# EasyEDA Pro project mspm0l1306拓展板.epro

# Schematic Schematic1_1
Create Date: 2024-07-17; Page Name: P1; Project Name: 2024电赛 7.17; Schematic Name: Schematic1; Update Date: 2024-07-18; Company: 嘉立创EDA; Page Size: A3; Version: V1.0
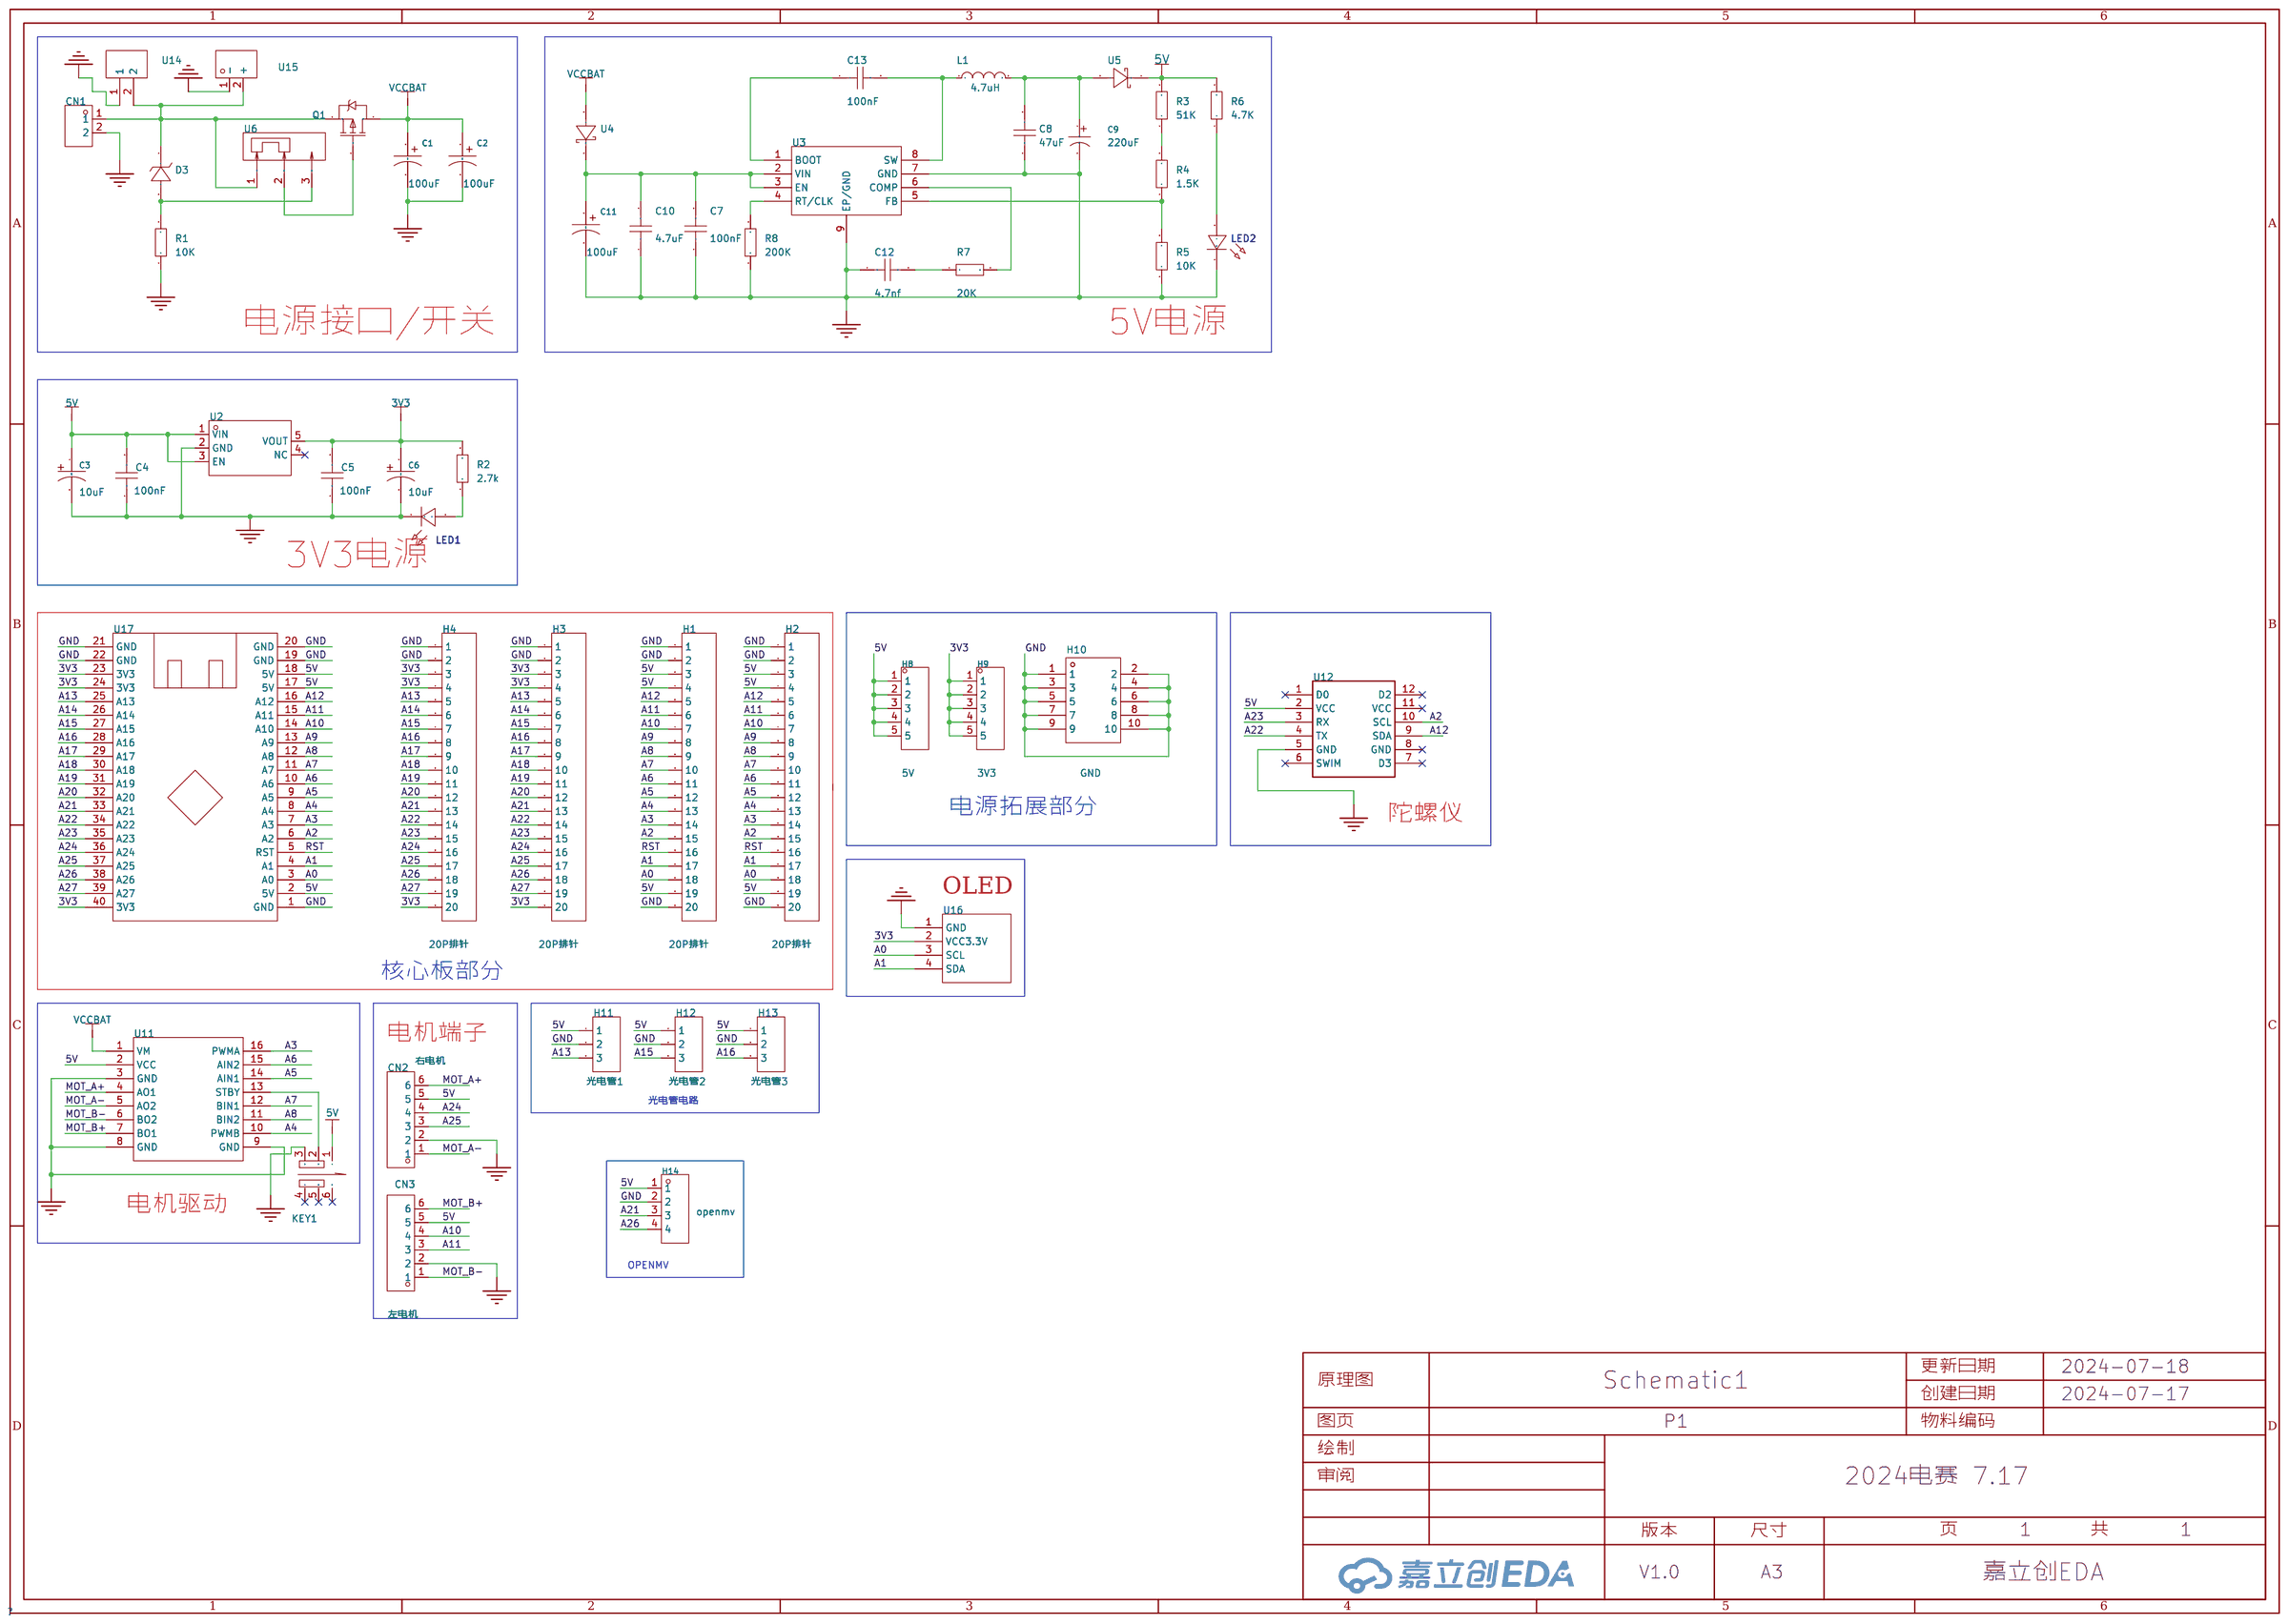
[diagram p0: schematic sheet]

## Parts
C1  100uF  [CAP-TH_BD8.0-P3.50-D0.6-FD_1]
C2  100uF  [CAP-TH_BD8.0-P3.50-D0.6-FD_1]
C3  10uF  [CAP-TH_BD8.0-P3.50-D0.6-FD_1]
C4  100nF  [C0805]
C5  100nF  [C0805]
C6  10uF  [CAP-TH_BD8.0-P3.50-D0.6-FD_1]
C7  100nF  [C0805]
C8  47uF  [C0805]
C9  220uF  [CAP-TH_BD8.0-P3.50-D0.6-FD_1]
C10  4.7uF  [C0805]
C11  100uF  [CAP-TH_BD8.0-P3.50-D0.6-FD_1]
C12  4.7nf  [C0805]
C13  100nF  [C0805]
CN1  XT30U-M  [CONN-TH_XT30U-M]
CN2  右电机  [CONN-TH_XH2.54-6P]
CN3  左电机  [CONN-TH_XH2.54-6P]
D3  BZT52C16  [SOD-123_L2.7-W1.6-LS3.7-RD]
H1  20P排针  [HDR-TH_20P-P2.54-V-F]
H2  20P排针  [HDR-TH_20P-P2.54-V-F]
H3  20P排针  [HDR-TH_20P-P2.54-V-F]
H4  20P排针  [HDR-TH_20P-P2.54-V-F]
H8  5V  [HDR-TH_5P-P2.54-V-M]
H9  3V3  [HDR-TH_5P-P2.54-V-M]
H10  GND  [HDR-TH_10P-P2.54-V-M-R2-C5-S2.54]
H11  光电管1  [HDR-F-2.54_1X3]
H12  光电管2  [HDR-F-2.54_1X3]
H13  光电管3  [HDR-F-2.54_1X3]
H14  openmv  [HDR-TH_4P-P2.54-V-F]
KEY1  自锁开关 5.8Z白灰白260G  [SW-TH_6P-L5.8-W5.8-P2.00-LS4.5-TR]
L1  4.7uH  [IND-TH_BD9.0-P5.00-D0.7]
LED1  -  [LED_0805]
LED2  -  [LED_0805]
Q1  HY19P03D  [TO-252-2_L6.6-W6.1-P4.57-LS9.9-TL-CW]
R1  10K  [R0805]
R2  2.7k  [R0805]
R3  51K  [R0805]
R4  1.5K  [R0805]
R5  10K  [R0805]
R6  4.7K  [R0805]
R7  20K  [R0805]
R8  200K  [R0805]
U2  RT9013-3.3GB  [SOT-23-5_L2.9-W1.6-P0.94-LS2.8-BL]
U3  -  [ESOP-8_L4.9-W3.9-P1.27-LS6.0-BL-EP3.1]
U4  SS54  [SMA_L4.2-W2.6-LS5.1-RD]
U5  SS54  [SMA_L4.2-W2.6-LS5.1-RD]
U6  SS-12D10-G5  [SW-TH_SS-12D10-G050]
U11  -  [tb6612]
U12  MPU6050(JY6X)  [维特陀螺仪]
U14  -  [T插头]
U15  XT60  [CONN-TH_XT60]
U16  -  [oled_4p]
U17  -  [MspM0L1306]

## Library data of the parts
C1 C2 C11 = 35YXF100MEFCTA8X11.5: 容值:100uF;精度:±20%;额定电压:35V;纹波电流:280mA@120Hz;等效串联电阻:-;; LCSC Part Name: 100uF ±20% 35V; Supplier Part: C1592816; Manufacturer: rubycon(红宝石); Supplier Footprint: 插件; JLCPCB Part Class: Extended Part; Datasheet: https://atta.szlcsc.com/upload/public/pdf/source/20220328/A5ADB66C04EDDB14C10F1D30FE958B67.pdf; Supplier: LCSC; Tolerance: ±20%; Rated Voltage: 35V; Lead Spacing: 3.5mm; Ripple Current: 280mA@120Hz; Lifetime @ Temp: 7000hrs@105℃; Operating Temperature: -40℃~+105℃
C3 C6 = LKMD0902E100MF: 容值:10uF;精度:±20%;额定电压:250V;纹波电流:210mA@100kHz;等效串联电阻:10Ω@100kHz;; LCSC Part Name: 10uF ±20% 250V; Supplier Part: C443244; Manufacturer: Ymin(永铭); Supplier Footprint: 插件,D8xL9mm; JLCPCB Part Class: Extended Part; Datasheet: https://atta.szlcsc.com/upload/public/pdf/source/20200220/C487520_443A40905984A455D375EE990FEAA9E8.pdf; Supplier: LCSC; Tolerance: ±20%; Rated Voltage: 250V; φD: 8mm; L: 9mm; Lead Spacing: 3.5mm; Ripple Current: 210mA@100kHz; Equivalent Series Resistance(ESR): 10Ω@100kHz; Lifetime @ Temp: 10000hrs@105℃
C4 C5 C7 C8 C10 C12 C13 = CAP_0805: Supplier Footprint: 0805
C9 = 25RX30220M8X11.5: 容值:220uF;精度:±20%;额定电压:25V;纹波电流:252mA@120Hz;等效串联电阻:220mΩ;; LCSC Part Name: 220uF ±20% 25V; Supplier Part: C1650893; Manufacturer: rubycon(红宝石); Supplier Footprint: 插件,D8xL11.5mm; JLCPCB Part Class: Extended Part; Datasheet: https://atta.szlcsc.com/upload/public/pdf/source/20210702/8607D86FC441D4E601D160AD5603FFB5.pdf; Supplier: LCSC; Tolerance: ±20%; Rated Voltage: 25V; φD: 8mm; L: 11.5mm; Lead Spacing: 3.5mm; Ripple Current: 252mA@120Hz; Equivalent Series Resistance(ESR): 220mΩ; Lifetime @ Temp: 2000hrs@130℃; Operating Temperature: -40℃~+130℃
CN1 = XT30U-M: 模型插头轻量版锂电池插头; LCSC Part Name: AMASS(艾迈斯)轻量版锂电池插头公头 XT30U-M; Supplier Part: C99101; Manufacturer: AMASS(艾迈斯); JLCPCB Part Class: Extended Part; Datasheet: https://atta.szlcsc.com/upload/public/pdf/source/20170606/1496716542582.pdf; Supplier: LCSC
CN2 CN3 = XH2.54*6P_直插: Supplier Part: C9900008614; Supplier Footprint: XH2.54_6P; JLCPCB Part Class: Extended Part; Supplier: LCSC
D3 = BZT52C16: 稳压值(标称值):-;精度:-;功率:500mW;反向电流(Ir):100nA@11.2V;; LCSC Part Name: 500mW; Supplier Part: C707145; Manufacturer: Slkor(萨科微); Supplier Footprint: SOD-123; JLCPCB Part Class: Extended Part; Datasheet: https://atta.szlcsc.com/upload/public/pdf/source/20200721/C707125_BAEA70ACC1B0F60BBAC1FD71D8806D24.pdf; Supplier: LCSC; Power Dissipation: 500mW; Reverse Leakage Current (Ir): 100nA@11.2V
H1-H4 = HDR-F_2.54_1x20P: Supplier Part: C50984; Supplier Footprint: 插件
H8 H9 = HDR-M_2.54_1x5P: Supplier Part: C358687; Supplier Footprint: 插件
H10 = HDR-M_2.54_2x5: Supplier Part: C124387; Supplier Footprint: 插件,P=2.54mm
H11-H13 = HDR-F-2.54_1x3: link: https://www.cjt.com/Upload/A2541.pdf; Supplier Part: C146690; Supplier: LCSC; JLCPCB Part Class: 扩展库
H14 = HDR-F_2.54_1x4P: Supplier Part: C2718488; Supplier Footprint: 插件
KEY1 = 自锁开关 5.8Z白灰白260G: 耐温260度; LCSC Part Name: 自锁开关 5.8Z白灰白 260G  5.8*5.8mm; Supplier Part: C56857; Supplier Footprint: Through Hole; JLCPCB Part Class: Extended Part; Datasheet: https://atta.szlcsc.com/upload/public/pdf/source/20160318/1458266987096.pdf; Supplier: LCSC
L1 = PK0810-470MB: 电感值:47uH;精度:±20%;额定电流:1.5A;; LCSC Part Name: 47uH ±20% 1.5A 100mΩ; Supplier Part: C400313; Manufacturer: SXN(顺翔诺); Supplier Footprint: 插件; JLCPCB Part Class: Extended Part; Datasheet: https://atta.szlcsc.com/upload/public/pdf/source/20210810/BA6D1DA7D4BCBB7C641BC97B42CFC6FF.pdf; Supplier: LCSC; Tolerance: ±20%; Rated Current: 1.5A; DC Resistance (DCR): 100mΩ
LED1 LED2 = LED_0805-G: Supplier Footprint: 0805
Q1 = HY19P03D: 类型:P沟道;漏源电压(Vdss):30V;连续漏极电流(Id):90A;功率(Pd):50W;导通电阻(RDS(on)@Vgs,Id):6mΩ@10V,45A;阈值电压(Vgs(th)@Id):3V@250uA;; LCSC Part Name: P沟道 30V 90A; Supplier Part: C122492; Manufacturer: HUAYI(华羿微); Supplier Footprint: TO-252-2; JLCPCB Part Class: Extended Part; Datasheet: https://atta.szlcsc.com/upload/public/pdf/source/20170728/C122492_1501225751911848809.pdf; Supplier: LCSC; Type: P沟道; Drain Source Voltage (Vdss): 30V; Continuous Drain Current (Id): 90A; Power Dissipation (Pd): 50W; Drain Source On Resistance (RDS(on)@Vgs,Id): 6mΩ@10V,45A; Gate Threshold Voltage (Vgs(th)@Id): 3V@250uA
R1-R8 = Res_0805: Supplier Footprint: 0805
U2 = RT9013-3.3GB: Supplier Part: C9900009203; Supplier Footprint: SOT-23-5; JLCPCB Part Class: Extended Part; Datasheet: 2022-03-03/158676S/05eef5539dd049ed90904f59fc365aec/RT9013_33GB_DS_EN.PDF; Supplier: LCSC
U3 = SP1N28STER
U4 U5 = SS54: Supplier Part: C9900023219; Supplier Footprint: (1N5824)DO-214; JLCPCB Part Class: Extended Part; Supplier: LCSC
U6 = SS-12D10-G5: LCSC Part Name: 插件大电流拨动开关; Supplier Part: C2998777; Manufacturer: DEALON(德艺隆); Supplier Footprint: 插件; JLCPCB Part Class: Extended Part; Datasheet: https://atta.szlcsc.com/upload/public/pdf/source/20220428/E10CB334ACBAF32CF4AF8D87DA871CD3.pdf; Supplier: LCSC
U11 = TB6612模块: STBY/VCC接3.3V VM接小于12V
U12 = 维特陀螺仪
U14 = T插头
U15 = XT60: 模型锂电连接器 XT60-M; LCSC Part Name: AMASS(艾迈斯) XT60模型插头 3.5mm镀金香蕉头公头（电调端）XT60-M; Supplier Part: C98733; Manufacturer: AMASS(艾迈斯); JLCPCB Part Class: Extended Part; Datasheet: https://atta.szlcsc.com/upload/public/pdf/source/20170606/1496716524919.pdf; Supplier: LCSC
U16 = OLED_4P
U17 = MspM0L1306核心板

## Nets
3V3: C5.2 C6.1 H3.3 H3.4 H3.20 H4.3 H4.4 H4.20 H9.1 H9.2 H9.3 H9.4 H9.5 R2.2 U2.5(VOUT) U16.2(VCC3.3V) U17.23(3V3) U17.24(3V3) U17.40(3V3)
5V: C3.1 C4.2 CN2.5 CN3.5 H1.3 H1.4 H1.19 H2.3 H2.4 H2.19 H8.1 H8.2 H8.3 H8.4 H8.5 H11.1 H12.1 H13.1 H14.1 KEY1.1 R3.2 R6.2 U2.1(VIN) U2.3(EN) U5.1(C) U11.2(VCC) U12.2(VCC) U17.2(5V) U17.17(5V) U17.18(5V)
GND: C1.2 C2.2 C3.2 C4.1 C5.1 C6.2 C7.1 C8.1 C9.2 C10.1 C11.2 C12.1 CN1.2 CN2.2 CN3.2 H1.1 H1.2 H1.20 H2.1 H2.2 H2.20 H3.1 H3.2 H4.1 H4.2 H10.1 H10.2 H10.3 H10.4 H10.5 H10.6 H10.7 H10.8 H10.9 H10.10 H11.2 H12.2 H13.2 H14.2 KEY1.3 LED1.1(C) LED2.1(C) R1.1 R5.1 R8.1 U2.2(GND) U3.7(GND) U3.9(EP/GND) U11.3(GND) U11.8(GND) U11.9(GND) U12.5(GND) U14.1 U15.1(-) U16.1(GND) U17.1(GND) U17.19(GND) U17.20(GND) U17.21(GND) U17.22(GND)
VCCBAT: C1.1 C2.1 Q1.2(D) U4.2(A) U11.1(VM)
A0: H1.18 H2.18 U16.3(SCL) U17.3(A0)
A1: H1.17 H2.17 U16.4(SDA) U17.4(A1)
A2: H1.15 H2.15 U12.10(SCL) U17.6(A2)
A3: H1.14 H2.14 U11.16(PWMA) U17.7(A3)
A4: H1.13 H2.13 U11.10(PWMB) U17.8(A4)
A5: H1.12 H2.12 U11.14(AIN1) U17.9(A5)
A6: H1.11 H2.11 U11.15(AIN2) U17.10(A6)
A7: H1.10 H2.10 U11.12(BIN1) U17.11(A7)
A8: H1.9 H2.9 U11.11(BIN2) U17.12(A8)
A9: H1.8 H2.8 U17.13(A9)
A10: CN3.4 H1.7 H2.7 U17.14(A10)
A11: CN3.3 H1.6 H2.6 U17.15(A11)
A12: H1.5 H2.5 U12.9(SDA) U17.16(A12)
A13: H3.5 H4.5 H11.3 U17.25(A13)
A14: H3.6 H4.6 U17.26(A14)
A15: H3.7 H4.7 H12.3 U17.27(A15)
A16: H3.8 H4.8 H13.3 U17.28(A16)
A17: H3.9 H4.9 U17.29(A17)
A18: H3.10 H4.10 U17.30(A18)
A19: H3.11 H4.11 U17.31(A19)
A20: H3.12 H4.12 U17.32(A20)
A21: H3.13 H4.13 H14.3 U17.33(A21)
A22: H3.14 H4.14 U12.4(TX) U17.34(A22)
A23: H3.15 H4.15 U12.3(RX) U17.35(A23)
A24: CN2.4 H3.16 H4.16 U17.36(A24)
A25: CN2.3 H3.17 H4.17 U17.37(A25)
A26: H3.18 H4.18 H14.4 U17.38(A26)
A27: H3.19 H4.19 U17.39(A27)
MOT_A+: CN2.6 U11.4(AO1)
MOT_A-: CN2.1 U11.5(AO2)
MOT_B+: CN3.6 U11.7(BO1)
MOT_B-: CN3.1 U11.6(BO2)
RST: H1.16 H2.16 U17.5(RST)
$1N3369: LED1.2(A) R2.1
$1N3377: R8.2 U3.4(RT/CLK)
$1N3378: C7.2 C10.2 C11.1 U3.2(VIN) U3.3(EN) U4.1(C)
$1N3380: C12.2 R7.1
$1N3381: R7.2 U3.6(COMP)
$1N3382: C13.1 U3.1(BOOT)
$1N3383: C13.2 L1.1 U3.8(SW)
$1N3384: C8.2 C9.1 L1.2 U5.2(A)
$1N3386: R3.1 R4.2
$1N3387: R4.1 R5.2 U3.5(FB)
$1N3388: LED2.2(A) R6.1
Net-(CN1-1): CN1.1 D3.1(K) Q1.3(S) U6.1 U14.2 U15.2(+)
Net-(D3-2): D3.2(A) R1.2 U6.3
Net-(KEY1-2): KEY1.2 U11.13(STBY)
Net-(Q1-1): Q1.1(G) U6.2

Not connected (* = marked no-connect by the designer): KEY1 4* 5* 6*; U2 4(NC)*; U12 1(D0)* 6(SWIM)* 7(D3)* 8(GND)* 11(VCC)* 12(D2)*

## Notes on the sheet
- 电源接口/开关
- 5V电源
- 3V3电源
- 电源拓展部分
- 陀螺仪
- OLED
- 核心板部分
- 电机端子
- 光电管电路
- 电机驱动
- OPENMV

# Board PCB1_1
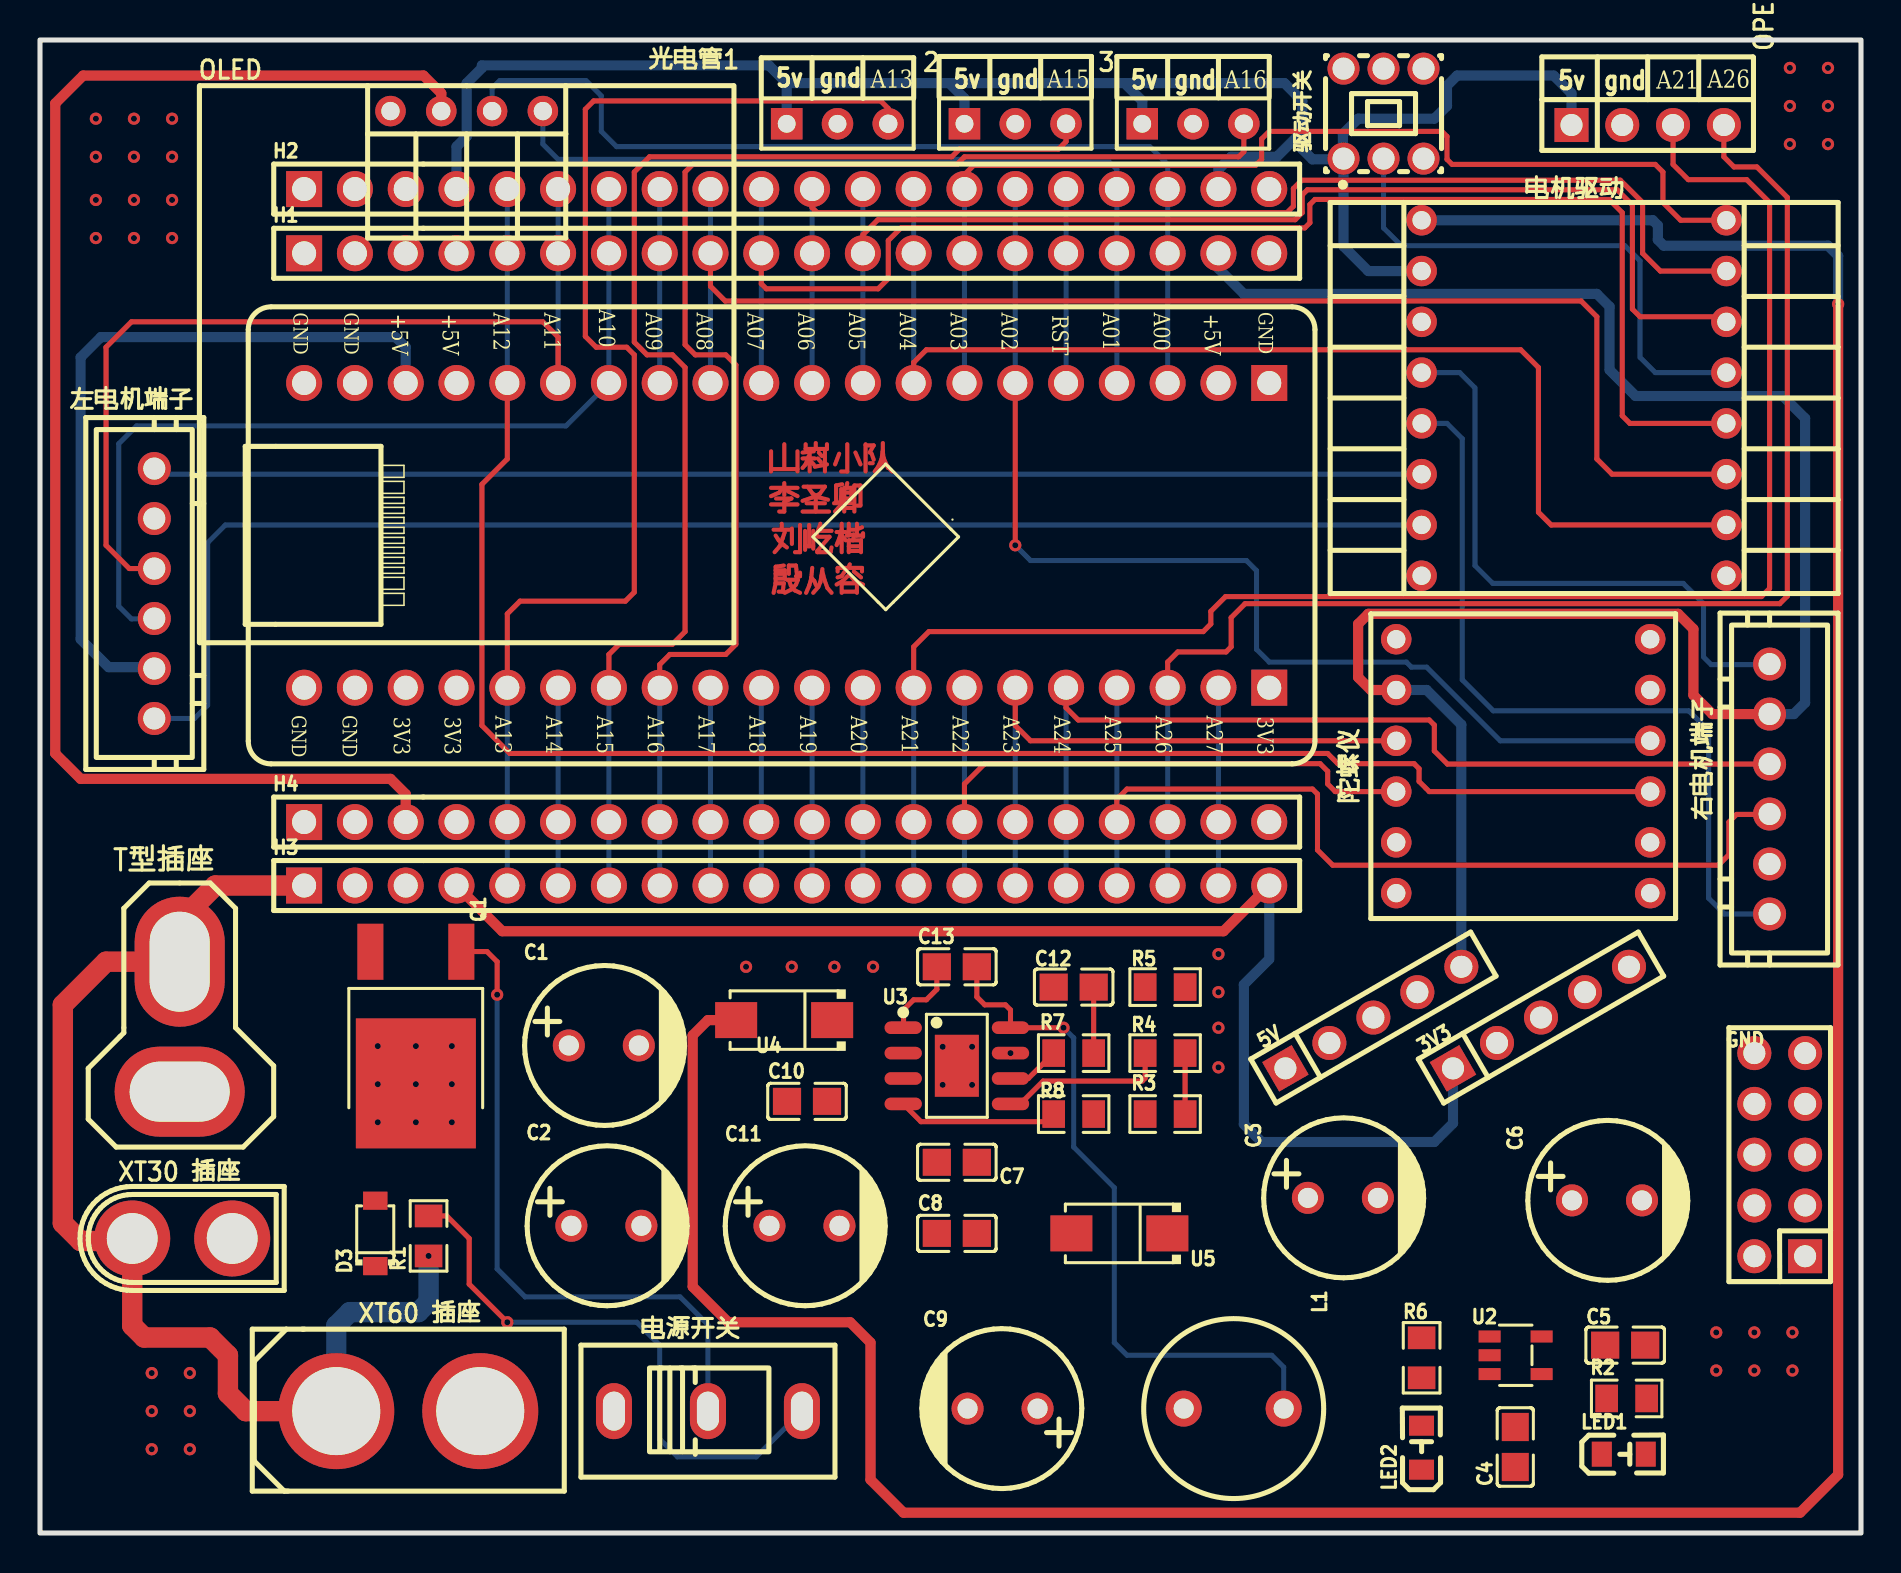
[diagram p1: board, top side]
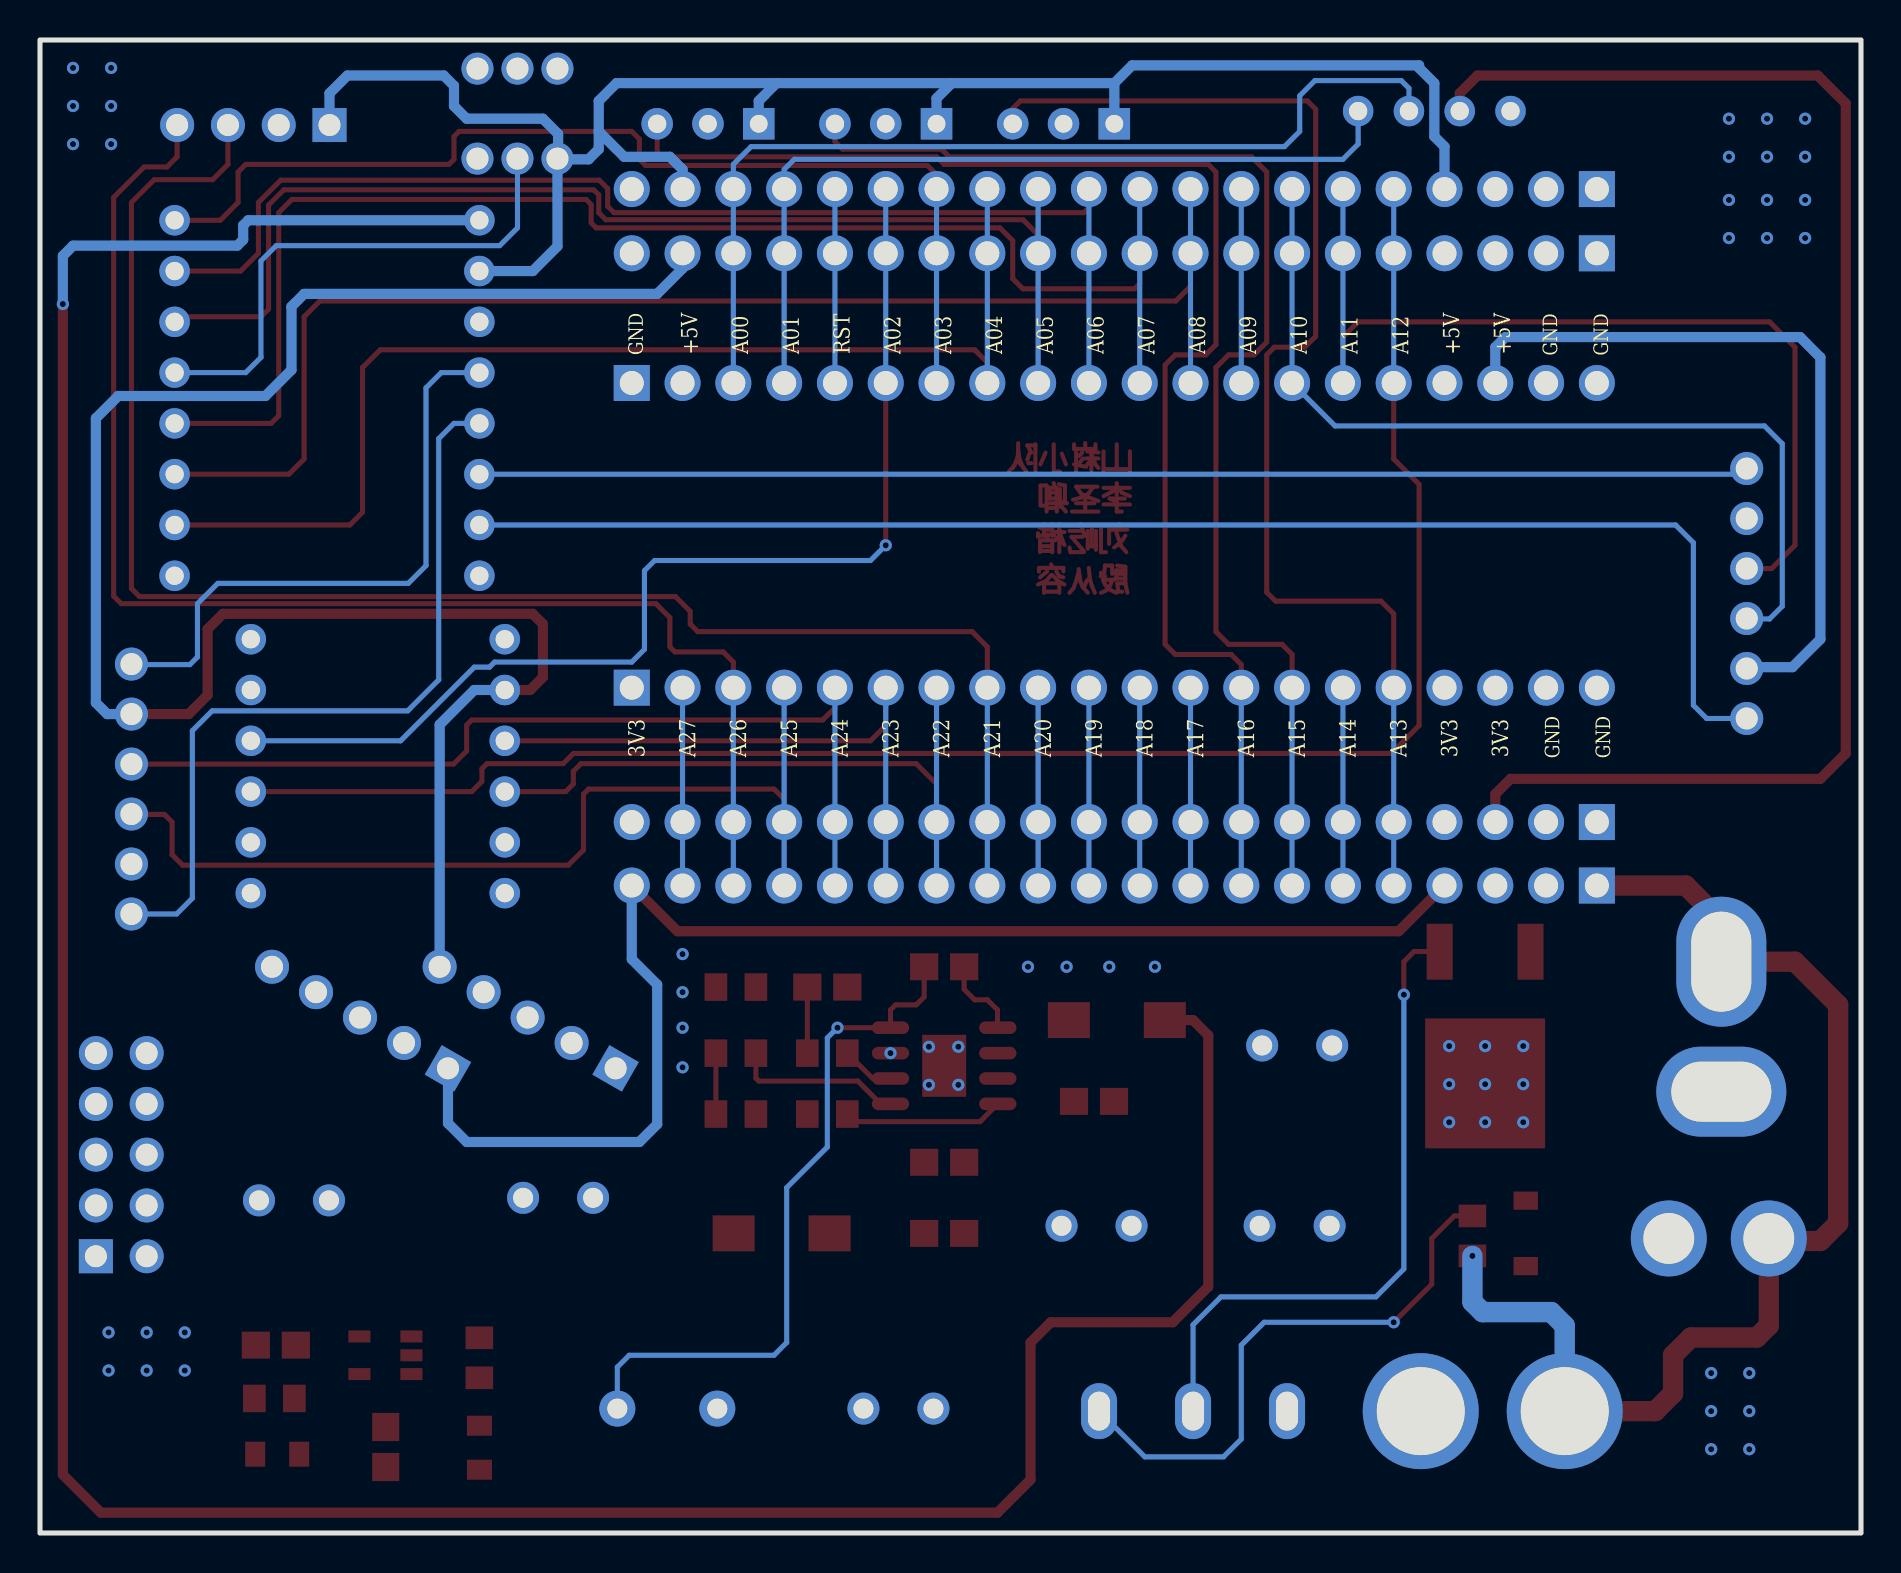
[diagram p2: board, bottom side, seen from below]

Outline 91.06 x 74.68 mm; copper layers: Top Layer, Bottom Layer. Coordinates in mm from the lower left corner of the outline.
Outline path: rectangle 0,74.68 91.06,0
Stack: Top Layer 0.035mm - / Dielectric1 1.51mm FR4 er 4.5 / Bottom Layer 0.035mm -

## Design rules (mm)
template: JLCPCB Capability(Two Layers Board)
spacing copperThickness1oz (default): track to track 0.102, other pairs 0.152 to 0.3
spacing copperThickness2oz: track to track 0.203, other pairs 0.152 to 0.3
track width copperThickness1oz (default): min 0.127, default 0.254, max 2.54
track width copperThickness2oz: min 0.203, default 0.254, max 2.54
differential pair differentialPair (default): width min 0.127, default 0.254, max 2.54; gap min 0.152, default 0.152
via viaSize (default): diameter min 0.5, default 0.61, max 10; hole min 0.3, default 0.305, max 6.3

## Placement (name value [footprint] x y rotation side)
2  -  [HDR-F-2.54_1X3]  48.77 70.48 0 top
3  -  [HDR-F-2.54_1X3]  57.66 70.48 0 top
3V3  -  [HDR-TH_5P-P2.54-V-M]  75.06 25.78 30 top
5V  -  [HDR-TH_5P-P2.54-V-M]  66.67 25.78 30 top
C1  100uF  [CAP-TH_BD8.0-P3.50-D0.6-FD_1]  28.19 24.38 0 top
C2  100uF  [CAP-TH_BD8.0-P3.50-D0.6-FD_1]  28.32 15.37 0 top
C3  10uF  [CAP-TH_BD8.0-P3.50-D0.6-FD_1]  65.15 16.76 0 top
C4  100nF  [C0805]  73.77 4.3 90 top
C5  100nF  [C0805]  79.27 9.4 180 top
C6  10uF  [CAP-TH_BD8.0-P3.50-D0.6-FD_1]  78.36 16.64 0 top
C7  100nF  [C0805]  45.85 18.54 180 top
C8  47uF  [C0805]  45.85 14.99 0 top
C9  220uF  [CAP-TH_BD8.0-P3.50-D0.6-FD_1]  48.13 6.22 180 top
C10  4.7uF  [C0805]  38.35 21.59 0 top
C11  100uF  [CAP-TH_BD8.0-P3.50-D0.6-FD_1]  38.23 15.37 0 top
C12  4.7nf  [C0805]  51.69 27.3 0 top
C13  100nF  [C0805]  45.85 28.32 0 top
D3  BZT52C16  [SOD-123_L2.7-W1.6-LS3.7-RD]  16.76 14.99 90 top
GND
  -  [HDR-TH_10P-P2.54-V-M-R2-C5-S2.54]  86.99 18.92 90 top
H1  20P排针  [HDR-TH_20P-P2.54-V-F]  37.34 64.01 0 top
H2  20P排针  [HDR-TH_20P-P2.54-V-F]  37.34 67.22 0 top
H3  20P排针  [HDR-TH_20P-P2.54-V-F]  37.34 32.38 0 top
H4  20P排针  [HDR-TH_20P-P2.54-V-F]  37.34 35.56 0 top
L1  4.7uH  [IND-TH_BD9.0-P5.00-D0.7]  59.69 6.22 180 top
LED1  -  [LED_0805]  79.25 3.94 0 top
LED2  -  [LED_0805]  69.09 4.32 90 top
NOREF  -  [Pad_e13e165]  33.53 57.52 180 top
NOREF#2  -  [Pad_e13e159]  18.29 57.52 180 top
NOREF#3  -  [Pad_e13e135]  56.39 57.52 180 top
NOREF#4  -  [Pad_e14e180]  36.07 42.28 180 top
NOREF#5  -  [Pad_e13e158]  15.75 57.52 180 top
NOREF#6  -  [Pad_e13e162]  25.91 57.52 180 top
NOREF#7  -  [Pad_e14e182]  30.99 42.28 180 top
NOREF#8  -  [Pad_e13e134]  53.85 57.52 180 top
NOREF#9  -  [Pad_e13e127]  36.07 57.52 180 top
NOREF#10  -  [Pad_e13e132]  48.77 57.52 180 top
NOREF#11  -  [Pad_e13e131]  46.23 57.52 180 top
NOREF#12  -  [Pad_e13e163]  28.45 57.52 180 top
NOREF#13  -  [Pad_e14e198]  28.45 42.28 180 top
NOREF#14  -  [Pad_e13e160]  20.83 57.52 180 top
NOREF#15  -  [Pad_e14e216]  15.75 42.28 180 top
NOREF#16  -  [Pad_e14e167]  23.37 42.28 180 top
NOREF#17  -  [Pad_e14e208]  43.69 42.28 180 top
NOREF#18  -  [Pad_e13e130]  43.69 57.52 180 top
NOREF#19  -  [Pad_e14e183]  38.61 42.28 180 top
NOREF#20  -  [Pad_e14e97]  51.31 42.28 180 top
NOREF#21  -  [Pad_e14e96]  53.85 42.28 180 top
NOREF#22  -  [Pad_e13e100]  58.93 57.52 180 top
NOREF#23  -  [Pad_e13e128]  38.61 57.52 180 top
NOREF#24  -  [Pad_e14e126]  58.93 42.28 180 top
NOREF#25  -  [Pad_e14e172]  25.91 42.28 180 top
NOREF#26  -  [Pad_e14e173]  20.83 42.28 180 top
NOREF#27  -  [Pad_e14e181]  33.53 42.28 180 top
NOREF#28  -  [Pad_e13e120]  61.47 57.52 180 top
NOREF#29  -  [Pad_e14e197]  18.29 42.28 180 top
NOREF#30  -  [Pad_e13e129]  41.15 57.52 180 top
NOREF#31  -  [Pad_e13e164]  30.99 57.52 180 top
NOREF#32  -  [Pad_e13e157]  13.21 57.52 180 top
NOREF#33  -  [Pad_e14e217]  13.21 42.28 180 top
NOREF#34  -  [Pad_e14e125]  61.47 42.28 180 top
NOREF#35  -  [Pad_e14e209]  41.15 42.28 180 top
NOREF#36  -  [Pad_e14e95]  56.39 42.28 180 top
NOREF#37  -  [Pad_e13e133]  51.31 57.52 180 top
NOREF#38  -  [Pad_e14e207]  46.23 42.28 180 top
NOREF#39  -  [Pad_e14e98]  48.77 42.28 180 top
NOREF#40  -  [Pad_e13e161]  23.37 57.52 180 top
OLED  -  [oled_4p]  21.34 71.12 0 top
OPENMV  -  [HDR-TH_4P-P2.54-V-F]  80.39 70.42 0 top
Q1  HY19P03D  [TO-252-2_L6.6-W6.1-P4.57-LS9.9-TL-CW]  18.8 25.78 270 top
R1  10K  [R0805]  19.43 14.86 90 top
R2  2.7k  [R0805]  79.34 6.73 180 top
R3  51K  [R0805]  56.26 20.95 180 top
R4  1.5K  [R0805]  56.26 24 0 top
R5  10K  [R0805]  56.26 27.3 180 top
R6  4.7K  [R0805]  69.09 8.76 90 top
R7  20K  [R0805]  51.69 24 180 top
R8  200K  [R0805]  51.69 20.95 180 top
T型插座  -  [T插头]  6.98 28.57 0 top
U2  RT9013-3.3GB  [SOT-23-5_L2.9-W1.6-P0.94-LS2.8-BL]  73.79 8.89 270 top
U3  -  [ESOP-8_L4.9-W3.9-P1.27-LS6.0-BL-EP3.1]  45.85 23.37 270 top
U4  SS54  [SMA_L4.2-W2.6-LS5.1-RD]  37.21 25.65 180 top
U5  SS54  [SMA_L4.2-W2.6-LS5.1-RD]  53.98 14.99 180 top
XT30 插座  -  [CONN-TH_XT30U-M]  7.11 14.73 180 top
XT60 插座  -  [CONN-TH_XT60]  18.41 6.1 0 top
光电管1  -  [HDR-F-2.54_1X3]  39.88 70.48 0 top
右电机端子  -  [CONN-TH_XH2.54-6P]  86.49 37.21 90 top
左电机端子  -  [CONN-TH_XH2.54-6P]  5.71 46.99 270 top
电机驱动  -  [tb6612]  76.71 56.9 0 top
电源开关  -  [SW-TH_SS-12D10-G050]  33.4 6.1 0 top
陀螺仪  -  [维特陀螺仪]  67.82 44.7 0 top
驱动开关  -  [SW-TH_6P-L5.8-W5.8-P2.00-LS4.5-TR]  67.18 70.99 180 top

## Footprints (pads in the part's own frame, mm; a bottom-side part is the same pattern mirrored in y, then rotated)
C0805
  rect 1.41x1.35 smd: 1(-1,0) 2(1,0)
CAP-TH_BD8.0-P3.50-D0.6-FD_1
  round 1.6 hole 1: 1(-1.75,0) 2(1.75,0)
CONN-TH_XH2.54-6P
  round 1.65 hole 1.1: 1(-6.25,0) 2(-3.75,0) 3(-1.25,0) 4(1.25,0) 5(3.75,0) 6(6.25,0)
CONN-TH_XT30U-M
  round 3.8 hole 2.54: 1(-2.5,0) 2(2.5,0)
CONN-TH_XT60
  round 5.8 hole 4.4: 1(-3.6,0) 2(3.6,0)
ESOP-8_L4.9-W3.9-P1.27-LS6.0-BL-EP3.1
  oval 0.63x1.865 smd: 1(-1.905,-2.683) 2(-0.635,-2.683) 3(0.635,-2.683) 4(1.905,-2.683) 5(1.905,2.683) 6(0.635,2.683) 7(-0.635,2.683) 8(-1.905,2.683)
  rect 3.1x2.2 smd: 9(0,0)
HDR-F-2.54_1X3
  rect 1.575x1.575 hole 0.889: 1(-2.54,0)
  round 1.575 hole 0.889: 2(0,0)
  round 1.575 hole 0.914: 3(2.54,0)
HDR-TH_4P-P2.54-V-F
  rect 1.7x1.7 hole 1.1: 1(-3.81,0)
  round 1.7 hole 1.1: 2(-1.27,0) 3(1.27,0) 4(3.81,0)
HDR-TH_5P-P2.54-V-M
  rect 1.7x1.7 hole 1.1: 1(-5.08,0)
  round 1.7 hole 1.1: 2(-2.54,0) 3(0,0) 4(2.54,0) 5(5.08,0)
HDR-TH_10P-P2.54-V-M-R2-C5-S2.54
  rect 1.7x1.7 hole 1.1: 1(-5.08,-1.27)
  round 1.7 hole 1.1: 2(-5.08,1.27) 3(-2.54,-1.27) 4(-2.54,1.27) 5(0,-1.27) 6(0,1.27) 7(2.54,-1.27) 8(2.54,1.27) 9(5.08,-1.27) 10(5.08,1.27)
HDR-TH_20P-P2.54-V-F
  rect 1.8x1.8 hole 1.2: 1(-24.13,0)
  round 1.8 hole 1.2: 2(-21.59,0) 3(-19.05,0) 4(-16.51,0) 5(-13.97,0) 6(-11.43,0) 7(-8.89,0) 8(-6.35,0) 9(-3.81,0) 10(-1.27,0) 11(1.27,0) 12(3.81,0) 13(6.35,0) 14(8.89,0) 15(11.43,0) 16(13.97,0) 17(16.51,0) 18(19.05,0) 19(21.59,0) 20(24.13,0)
IND-TH_BD9.0-P5.00-D0.7
  round 1.8 hole 1: 1(-2.5,0) 2(2.5,0)
LED_0805
  rect 1x1.25 smd: 1(-1.15,0.005) 2(1.05,0.005)
oled_4p
  round 1.524 hole 0.914: 1(-3.81,0) 2(-1.27,0) 3(1.27,0) 4(3.81,0)
Pad_e13e100
  round 1.8 hole 1.2: 2(0,0)
Pad_e13e120
  rect 1.8x1.8 hole 1.2: 1(0,0)
Pad_e13e127
  round 1.8 hole 1.2: 11(0,0)
Pad_e13e128
  round 1.8 hole 1.2: 10(0,0)
Pad_e13e129
  round 1.8 hole 1.2: 9(0,0)
Pad_e13e130
  round 1.8 hole 1.2: 8(0,0)
Pad_e13e131
  round 1.8 hole 1.2: 7(0,0)
Pad_e13e132
  round 1.8 hole 1.2: 6(0,0)
Pad_e13e133
  round 1.8 hole 1.2: 5(0,0)
Pad_e13e134
  round 1.8 hole 1.2: 4(0,0)
Pad_e13e135
  round 1.8 hole 1.2: 3(0,0)
Pad_e13e157
  round 1.8 hole 1.2: 20(0,0)
Pad_e13e158
  round 1.8 hole 1.2: 19(0,0)
Pad_e13e159
  round 1.8 hole 1.2: 18(0,0)
Pad_e13e160
  round 1.8 hole 1.2: 17(0,0)
Pad_e13e161
  round 1.8 hole 1.2: 16(0,0)
Pad_e13e162
  round 1.8 hole 1.2: 15(0,0)
Pad_e13e163
  round 1.8 hole 1.2: 14(0,0)
Pad_e13e164
  round 1.8 hole 1.2: 13(0,0)
Pad_e13e165
  round 1.8 hole 1.2: 12(0,0)
Pad_e14e95
  round 1.8 hole 1.2: 38(0,0)
Pad_e14e96
  round 1.8 hole 1.2: 37(0,0)
Pad_e14e97
  round 1.8 hole 1.2: 36(0,0)
Pad_e14e98
  round 1.8 hole 1.2: 35(0,0)
Pad_e14e125
  rect 1.8x1.8 hole 1.2: 40(0,0)
Pad_e14e126
  round 1.8 hole 1.2: 39(0,0)
Pad_e14e167
  round 1.8 hole 1.2: 25(0,0)
Pad_e14e172
  round 1.8 hole 1.2: 26(0,0)
Pad_e14e173
  round 1.8 hole 1.2: 24(0,0)
Pad_e14e180
  round 1.8 hole 1.2: 30(0,0)
Pad_e14e181
  round 1.8 hole 1.2: 29(0,0)
Pad_e14e182
  round 1.8 hole 1.2: 28(0,0)
Pad_e14e183
  round 1.8 hole 1.2: 31(0,0)
Pad_e14e197
  round 1.8 hole 1.2: 23(0,0)
Pad_e14e198
  round 1.8 hole 1.2: 27(0,0)
Pad_e14e207
  round 1.8 hole 1.2: 34(0,0)
Pad_e14e208
  round 1.8 hole 1.2: 33(0,0)
Pad_e14e209
  round 1.8 hole 1.2: 32(0,0)
Pad_e14e216
  round 1.8 hole 1.2: 22(0,0)
Pad_e14e217
  round 1.8 hole 1.2: 21(0,0)
R0805
  rect 1.133x1.377 smd: 1(-1,0) 2(1,0)
SMA_L4.2-W2.6-LS5.1-RD
  rect 2.1x1.8 smd: 1(-2.4,0) 2(2.4,0)
SOD-123_L2.7-W1.6-LS3.7-RD
  rect 0.91x1.22 smd: 1(-1.635,0) 2(1.635,0)
SOT-23-5_L2.9-W1.6-P0.94-LS2.8-BL
  rect 0.6x1.1 smd: 1(-0.94,-1.3) 2(0,-1.3) 3(0.94,-1.3) 4(0.94,1.3) 5(-0.94,1.3)
SW-TH_6P-L5.8-W5.8-P2.00-LS4.5-TR
  round 1.6 hole 1.1: 1(2,2.25) 2(0,2.25) 3(-2,2.25) 4(-2,-2.25) 5(0,-2.25) 6(2,-2.25)
SW-TH_SS-12D10-G050
  oval 1.8x2.8 hole 1.1x1.95: 1(-4.7,0) 2(0,0) 3(4.7,0)
tb6612
  round 1.524 hole 0.914: 1(-7.62,8.763) 2(-7.62,6.223) 3(-7.62,3.683) 4(-7.62,1.143) 5(-7.62,-1.397) 6(-7.62,-3.937) 7(-7.62,-6.477) 8(-7.62,-9.017) 9(7.62,-9.017) 10(7.62,-6.477) 11(7.62,-3.937) 12(7.62,-1.397) 13(7.62,1.143) 14(7.62,3.683) 15(7.62,6.223) 16(7.62,8.763)
TO-252-2_L6.6-W6.1-P4.57-LS9.9-TL-CW
  rect 2.8x1.3 smd: 1(-3.292,2.273) 3(-3.292,-2.273)
  rect 6.5x6 smd: 2(3.292,0)
T插头
  oval 4.5x6.5 hole 3x5: 1(0,0)
  oval 6.5x4.5 hole 5x3: 2(0,-6.5)
维特陀螺仪
  round 1.524 hole 0.914: 1(0,0) 2(0,-2.54) 3(0,-5.08) 4(0,-7.62) 5(0,-10.16) 6(0,-12.7) 7(12.7,-12.7) 8(12.7,-10.16) 9(12.7,-7.62) 10(12.7,-5.08) 11(12.7,-2.54) 12(12.7,0)

## Nets
3V3: 3V3.1 3V3.2 3V3.3 3V3.4 3V3.5 C5.2 C6.1 H3.3 H3.4 H3.20 H4.3 H4.4 H4.20 NOREF#26.24 NOREF#29.23 NOREF#34.40 OLED.2 R2.2 U2.5
5V: 2.1 3.1 5V.1 5V.2 5V.3 5V.4 5V.5 C3.1 C4.2 H1.3 H1.4 H1.19 H2.3 H2.4 H2.19 NOREF#2.18 NOREF#14.17 NOREF#22.2 OPENMV.1 R3.2 R6.2 U2.1 U2.3 U5.1 光电管1.1 右电机端子.5 左电机端子.5 电机驱动.2 陀螺仪.2 驱动开关.1
GND: 2.2 3.2 C1.2 C2.2 C3.2 C4.1 C5.1 C6.2 C7.1 C8.1 C9.2 C10.1 C11.2 C12.1 GND
.1 GND
.2 GND
.3 GND
.4 GND
.5 GND
.6 GND
.7 GND
.8 GND
.9 GND
.10 H1.1 H1.2 H1.20 H2.1 H2.2 H2.20 H3.1 H3.2 H4.1 H4.2 LED1.1 LED2.1 NOREF#5.19 NOREF#15.22 NOREF#28.1 NOREF#32.20 NOREF#33.21 OLED.1 OPENMV.2 R1.1 R5.1 R8.1 T型插座.1 U2.2 U3.7 U3.9 XT30 插座.2 XT60 插座.1 光电管1.2 右电机端子.2 左电机端子.2 电机驱动.3 电机驱动.8 电机驱动.9 陀螺仪.5 驱动开关.3
VCCBAT: C1.1 C2.1 Q1.2 U4.2 电机驱动.1
A0: H1.18 H2.18 NOREF#3.3 OLED.3
A1: H1.17 H2.17 NOREF#8.4 OLED.4
A2: H1.15 H2.15 NOREF#10.6 陀螺仪.10
A3: H1.14 H2.14 NOREF#11.7 电机驱动.16
A4: H1.13 H2.13 NOREF#18.8 电机驱动.10
A5: H1.12 H2.12 NOREF#30.9 电机驱动.14
A6: H1.11 H2.11 NOREF#23.10 电机驱动.15
A7: H1.10 H2.10 NOREF#9.11 电机驱动.12
A8: H1.9 H2.9 NOREF.12 电机驱动.11
A9: H1.8 H2.8 NOREF#31.13
A10: H1.7 H2.7 NOREF#12.14 左电机端子.4
A11: H1.6 H2.6 NOREF#6.15 左电机端子.3
A12: H1.5 H2.5 NOREF#40.16 陀螺仪.9
A13: H3.5 H4.5 NOREF#16.25 光电管1.3
A14: H3.6 H4.6 NOREF#25.26
A15: 2.3 H3.7 H4.7 NOREF#13.27
A16: 3.3 H3.8 H4.8 NOREF#7.28
A17: H3.9 H4.9 NOREF#27.29
A18: H3.10 H4.10 NOREF#4.30
A19: H3.11 H4.11 NOREF#19.31
A20: H3.12 H4.12 NOREF#35.32
A21: H3.13 H4.13 NOREF#17.33 OPENMV.3
A22: H3.14 H4.14 NOREF#38.34 陀螺仪.4
A23: H3.15 H4.15 NOREF#39.35 陀螺仪.3
A24: H3.16 H4.16 NOREF#20.36 右电机端子.4
A25: H3.17 H4.17 NOREF#21.37 右电机端子.3
A26: H3.18 H4.18 NOREF#36.38 OPENMV.4
A27: H3.19 H4.19 NOREF#24.39
MOT_A+: 右电机端子.6 电机驱动.4
MOT_A-: 右电机端子.1 电机驱动.5
MOT_B+: 左电机端子.6 电机驱动.7
MOT_B-: 左电机端子.1 电机驱动.6
RST: H1.16 H2.16 NOREF#37.5
$1N3365: Q1.1 电源开关.2
$1N3366: D3.2 R1.2 电源开关.3
$1N3369: LED1.2 R2.1
$1N3374: D3.1 Q1.3 T型插座.2 XT30 插座.1 XT60 插座.2 电源开关.1
$1N3377: R8.2 U3.4
$1N3378: C7.2 C10.2 C11.1 U3.2 U3.3 U4.1
$1N3380: C12.2 R7.1
$1N3381: R7.2 U3.6
$1N3382: C13.1 U3.1
$1N3383: C13.2 L1.1 U3.8
$1N3384: C8.2 C9.1 L1.2 U5.2
$1N3386: R3.1 R4.2
$1N3387: R4.1 R5.2 U3.5
$1N3388: LED2.2 R6.1
$1N3826: 电机驱动.13 驱动开关.2

Pads without a net: U2 4; 陀螺仪 1 6 7 8 11 12; 驱动开关 4 5 6

## Via types
v1: diameter 0.61, hole 0.305, Top Layer to Bottom Layer, 58 vias

## Routing (per net, layer and track width the routed paths; a pad name or vN(x,y) marks a point on that pad's centre or on a via; arc(x,y) is an arc through that point)
3V3: length 142.4
  Top Layer w0.508: H4.3 18.29,36.96 17.53,37.72 2.03,37.72 0.76,38.99 0.76,71.5 2.16,72.9 19.18,72.9 20.07,72.01 OLED.2 ; H3.20 59.18,30.1 23.11,30.1 H3.4
  Bottom Layer w0.508: H3.20 61.47,28.7 60.2,27.43 60.2,20.45 61.09,19.56 69.72,19.56 70.66,20.49 3V3.1
5V: length 225.2
  Top Layer w0.508: 右电机端子.5 83.63,40.96 82.68,41.91 82.68,45.21 81.92,45.97 66.42,45.97 65.91,45.47 65.91,42.8 66.55,42.16 陀螺仪.2
  Bottom Layer w0.508: 3.1 55.12,71.63 54.23,72.52 ; OPENMV.1 76.58,72.01 75.69,72.9 70.87,72.9 70.36,72.39 70.36,71.37 69.72,70.74 65.91,70.74 65.15,69.98 65.15,68.77 驱动开关.1 ; 54.23,72.52 62.23,72.52 63.12,71.63 63.12,70.1 ; 54.23,72.52 45.47,72.52 ; 63.12,70.1 63.12,69.21 63.63,68.71 65.15,68.71 驱动开关.1 ; 63.12,70.1 61.85,68.83 59.56,68.83 58.93,68.2 H2.19 ; 45.47,72.52 37.34,72.52 ; 45.47,72.52 46.23,71.75 2.1 ; 37.34,72.52 光电管1.1 ; 37.34,72.52 36.45,73.41 22.1,73.41 22.1,73.28 21.34,72.52 21.34,69.85 20.83,69.34 H2.4 ; 电机驱动.2 66.42,63.12 65.18,64.36 驱动开关.1 ; H1.19 58.93,63.25 60.2,61.98 77.85,61.98 78.49,61.34 78.49,58.17 79.79,56.87 87.15,56.87 88.27,55.75 88.27,41.53 87.7,40.96 右电机端子.5 ; 左电机端子.5 5.65,43.31 3.43,43.31 2.03,44.7 2.03,58.8 3.05,59.82 17.78,59.82 18.29,59.31 NOREF#2.18 ; 陀螺仪.2 69.34,42.16 71.07,40.43 5V.5
GND: length 59.7
  Top Layer w1.016: XT60 插座.1 10.29,6.1 9.4,6.98 9.4,8.89 8.51,9.78 5.21,9.78 4.61,10.37 XT30 插座.2 4.48,14.6 2.03,14.6 1.14,15.49 1.14,26.42 3.3,28.57 T型插座.1 6.98,30.61 8.76,32.38 H3.1
  Bottom Layer w1.016: v1(19.43,13.86) 19.43,11.56 18.92,11.05 15.49,11.05 14.81,10.37 XT60 插座.1
  vias: v1(2.79,70.74) v1(2.79,68.83) v1(2.79,66.67) v1(2.79,64.77) v1(4.7,70.74) v1(4.7,68.83) v1(4.7,66.67) v1(4.7,64.77) v1(5.59,8) v1(5.59,6.1) v1(5.59,4.19) v1(6.6,70.74) v1(6.6,68.83) v1(6.6,66.67) v1(6.6,64.77) v1(7.49,8) v1(7.49,6.1) v1(7.49,4.19) v1(35.31,28.32) v1(37.59,28.32) v1(39.72,28.32) v1(41.66,28.32) v1(45.14,24.32) v1(45.14,22.42) v1(46.61,24.32) v1(46.61,22.42) v1(48.53,24) v1(58.93,28.96) v1(58.93,27.05) v1(58.93,25.27) v1(58.93,23.29) v1(83.82,10.03) v1(83.82,8.13) v1(85.73,10.03) v1(85.73,8.13) v1(87.5,73.28) v1(87.5,71.37) v1(87.5,69.47) v1(87.63,10.03) v1(87.63,8.13) v1(89.41,73.28) v1(89.41,71.37) v1(89.41,69.47)
VCCBAT: length 164.8
  Top Layer w0.508: v1(89.92,61.47) 89.92,2.92 88.01,1.02 43.18,1.02 41.53,2.67 41.53,9.52 40.51,10.54 34.42,10.54 32.64,12.32 32.64,24.89 33.4,25.65 U4.2
  Bottom Layer w0.508: v1(89.92,61.47) 89.92,63.88 89.41,64.39 81.2,64.39 80.9,64.69 80.9,65.4 80.64,65.66 电机驱动.1
  vias: v1(16.89,24.35) v1(16.89,22.45) v1(16.89,20.54) v1(18.8,24.35) v1(18.8,22.45) v1(18.8,20.54) v1(20.59,24.35) v1(20.59,22.45) v1(20.59,20.54)
A0: length 48.8
  Bottom Layer w0.254: NOREF#3.3 H1.18 H2.18 56.39,68.45 55.5,69.34 28.83,69.34 28.07,70.1 28.07,71.88 27.3,72.64 22.99,72.64 22.61,72.26 OLED.3
A1: length 41.6
  Bottom Layer w0.254: NOREF#8.4 H1.17 H2.17 53.85,68.2 53.34,68.71 25.91,68.71 25.15,69.47 OLED.4
A2: length 55.9
  Top Layer w0.254: v1(48.77,49.4) NOREF#10.6
  Bottom Layer w0.254: H2.15 H1.15 NOREF#10.6 ; v1(48.77,49.4) 49.53,48.64 60.33,48.64 60.83,48.13 60.83,44.2 61.47,43.56 68.33,43.56 68.58,43.31 69.34,43.31 73.02,39.62 陀螺仪.10
A3: length 53.4
  Top Layer w0.254: H2.14 46.23,67.94 46.68,68.4 60.78,68.4 61.09,68.71 61.09,69.72 61.47,70.1 70.1,70.1 70.36,69.85 70.36,68.71 70.61,68.45 80.77,68.45 81.15,68.07 81.15,66.55 82.04,65.66 电机驱动.16
  Bottom Layer w0.254: NOREF#11.7 H1.14 H2.14
A4: length 59.5
  Top Layer w0.254: 84.33,50.42 75.56,50.42 74.93,51.05 74.93,58.29 74.04,59.18 44.32,59.18 43.69,58.55 NOREF#18.8
  Bottom Layer w0.254: H2.13 H1.13 NOREF#18.8
A5: length 61
  Top Layer w0.254: 84.33,60.58 84.07,60.83 80.01,60.83 79.63,61.21 79.63,66.42 78.87,67.18 63.37,67.18 63.12,66.93 63.12,66.04 62.76,65.68 41.9,65.68 41.15,64.93 H1.12
  Bottom Layer w0.254: H2.12 H1.12 NOREF#30.9
A6: length 61
  Top Layer w0.254: 电机驱动.15 81.03,63.12 80.14,64.01 80.14,66.55 79.02,67.66 63.09,67.66 62.67,67.25 62.67,66.36 62.36,66.04 38.86,66.04 38.61,66.29 H2.11
  Bottom Layer w0.254: NOREF#23.10 H1.11 H2.11
A7: length 73.7
  Top Layer w0.254: H1.10 36.07,62.48 36.32,62.23 41.91,62.23 42.42,62.74 42.42,64.64 43.05,65.28 63.25,65.28 63.5,65.53 63.5,66.45 63.75,66.7 78.46,66.7 79.12,66.04 79.12,55.88 79.5,55.5 84.33,55.5
  Bottom Layer w0.254: H2.10 H1.10 NOREF#9.11
A8: length 70.2
  Top Layer w0.254: 电机驱动.11 78.61,52.96 77.85,53.72 77.85,60.83 77.06,61.62 34.26,61.62 33.53,62.36 H1.9
  Bottom Layer w0.254: NOREF.12 H1.9 H2.9
A9: length 9.7
  Bottom Layer w0.254: NOREF#31.13 H1.8 H2.8
A10: length 45.6
  Bottom Layer w0.254: 左电机端子.4 5.69,45.72 4.57,45.72 3.94,46.35 3.94,54.48 4.83,55.37 26.3,55.37 NOREF#12.14 H1.7 H2.7
A11: length 48.2
  Top Layer w0.254: NOREF#6.15 25.91,59.82 25.15,60.58 4.57,60.58 3.3,59.31 3.3,49.4 4.46,48.24 左电机端子.3
  Bottom Layer w0.254: H2.6 H1.6 NOREF#6.15
A12: length 87.5
  Top Layer w0.254: 陀螺仪.9 69.47,37.08 68.96,37.59 68.96,38.23 68.71,38.48 64.9,38.48 64.39,38.99 23.49,38.99 22.1,40.39 22.1,52.45 23.37,53.72 NOREF#40.16
  Bottom Layer w0.254: NOREF#40.16 H1.5 H2.5
A13: length 62.7
  Top Layer w0.254: 光电管1.3 42.42,71.25 42.04,71.63 27.69,71.63 27.27,71.21 27.27,59.85 27.81,59.31 29.34,59.31 29.72,58.93 29.72,47.06 29.27,46.61 24,46.61 23.37,45.97 NOREF#16.25
  Bottom Layer w0.254: H3.5 H4.5 NOREF#16.25
A14: length 9.9
  Bottom Layer w0.254: H3.6 H4.6 NOREF#25.26
A15: length 63.7
  Top Layer w0.254: 2.3 51.31,69.6 50.93,69.21 45.97,69.21 45.59,68.83 30.48,68.83 29.72,68.07 29.72,59.56 30.35,58.93 31.62,58.93 32.26,58.29 32.26,45.08 31.62,44.45 28.96,44.45 28.45,43.94 NOREF#13.27
  Bottom Layer w0.254: H3.7 H4.7 NOREF#13.27
A16: length 70.6
  Top Layer w0.254: NOREF#7.28 30.99,43.43 31.5,43.94 34.29,43.94 34.8,44.45 34.8,58.42 34.29,58.93 32.77,58.93 32.26,59.44 32.26,68.07 32.64,68.45 45.85,68.45 46.23,68.83 59.94,68.83 60.2,69.09 3.3
  Bottom Layer w0.254: NOREF#7.28 H4.8 H3.8
A17: length 9.9
  Bottom Layer w0.254: NOREF#27.29 H4.9 H3.9
A18: length 9.9
  Bottom Layer w0.254: H3.10 H4.10 NOREF#4.30
A19: length 10.4
  Bottom Layer w0.254: 38.28,35.89 H4.11 ; H4.11 NOREF#19.31 ; H4.11 H3.11
A20: length 9.9
  Bottom Layer w0.254: H3.12 H4.12 NOREF#35.32
A21: length 83.2
  Top Layer w0.254: NOREF#17.33 43.69,44.32 44.45,45.08 58.17,45.08 58.55,45.47 58.55,46.1 59.28,46.84 86.08,46.84 86.49,47.24 86.49,66.55 85.34,67.69 82.42,67.69 81.66,68.45 OPENMV.3
  Bottom Layer w0.254: NOREF#17.33 H4.13 H3.13
A22: length 34.8
  Top Layer w0.254: H4.14 46.23,37.46 47.24,38.48 64.01,38.48 64.39,38.1 64.39,37.46 64.77,37.08 陀螺仪.4
  Bottom Layer w0.254: H3.14 H4.14 NOREF#38.34
A23: length 31.2
  Top Layer w0.254: NOREF#39.35 48.77,40.39 49.53,39.62 陀螺仪.3
  Bottom Layer w0.254: NOREF#39.35 H4.15 H3.15
A24: length 48
  Top Layer w0.254: NOREF#20.36 51.31,41.27 51.92,40.67 69.47,40.67 69.72,40.41 69.72,39.12 70.38,38.46 右电机端子.4
  Bottom Layer w0.254: H3.16 H4.16 NOREF#20.36
A25: length 49.1
  Top Layer w0.254: H4.17 53.85,36.7 54.36,37.21 63.63,37.21 63.88,36.96 63.88,34.16 64.64,33.4 83.93,33.4 84.45,33.93 84.45,35.56 84.84,35.94 86.47,35.94 右电机端子.3
  Bottom Layer w0.254: NOREF#21.37 H4.17 H3.17
A26: length 69.9
  Top Layer w0.254: NOREF#36.38 56.39,43.56 56.9,44.07 59.31,44.07 59.56,44.32 59.56,45.78 60.26,46.48 86.99,46.48 87.38,46.86 87.38,66.8 85.85,68.33 84.71,68.33 84.2,68.83 OPENMV.4
  Bottom Layer w0.254: NOREF#36.38 H4.18 H3.18
A27: length 9.9
  Bottom Layer w0.254: H3.19 H4.19 NOREF#24.39
MOT_A+: length 30.2
  Bottom Layer w0.254: 电机驱动.4 70.99,58.04 71.75,57.28 71.75,48.39 72.64,47.5 82.17,47.5 83.18,46.48 83.18,43.81 83.57,43.43 86.46,43.43 右电机端子.6
MOT_A-: length 39.5
  Bottom Layer w0.254: 69.09,55.5 70.36,55.5 71.12,54.74 71.12,42.67 72.67,41.12 82.45,41.12 83.44,40.13 83.44,31.75 84.23,30.96 右电机端子.1
MOT_B+: length 72.1
  Bottom Layer w0.254: 左电机端子.6 7.72,40.74 8.38,41.4 8.38,49.53 9.27,50.42 69.09,50.42
MOT_B-: length 63.5
  Bottom Layer w0.254: 电机驱动.6 6,52.96 左电机端子.1
RST: length 9.7
  Bottom Layer w0.254: H2.16 H1.16 NOREF#37.5
$1N3365: length 33.4
  Top Layer w0.254: v1(22.86,26.92) 22.86,28.57 22.35,29.08 21.08,29.08 Q1.1
  Bottom Layer w0.254: 电源开关.2 33.4,10.41 32,11.81 24.26,11.81 22.86,13.21 v1(22.86,26.92)
$1N3366: length 28.7
  Top Layer w0.254: R1.2 20.34,15.86 21.46,14.73 21.46,12.45 v1(23.37,10.54)
  Bottom Layer w0.254: v1(23.37,10.54) 29.84,10.54 30.99,9.4 30.99,4.7 31.88,3.81 35.81,3.81 电源开关.3
$1N3377: length 8.1
  Top Layer w0.254: R8.2 50.31,20.57 44.05,20.57 U3.4
$1N3380: length 3.3
  Top Layer w0.254: C12.2 R7.1
$1N3381: length 2.7
  Top Layer w0.254: U3.6 49.42,22.73 R7.2
$1N3382: length 4.1
  Top Layer w0.254: C13.1 44.85,27.19 44.32,26.67 43.69,26.67 43.18,26.16 43.18,25.29 U3.1
$1N3383: length 34.9
  Top Layer w0.254: C13.2 46.85,26.81 47.24,26.42 48.28,26.42 48.53,26.16 U3.8 v1(51.18,25.27)
  Bottom Layer w0.254: v1(51.18,25.27) 51.69,24.76 51.69,19.3 53.72,17.27 53.72,9.52 54.36,8.89 61.59,8.89 62.19,8.29 L1.1
$1N3386: length 3
  Top Layer w0.254: R4.2 R3.1
$1N3387: length 8.5
  Top Layer w0.254: R4.1 55.26,22.75 55.12,22.61 50.17,22.61 49.02,21.46 U3.5
$1N3826: length 26.4
  Bottom Layer w0.254: 电机驱动.13 80.77,58.04 80.01,58.8 80.01,63.63 79.25,64.39 68.07,64.39 67.18,65.28 驱动开关.2

## Copper pours and planes (outline as drawn; the poured copper is in the pictures)
3V3 on Top Layer: 79.25,6.1 78.61,5.46 76.88,5.46 76.52,5.81 76.52,8.31 75.95,8.89 74.3,8.89 73.91,9.27 73.91,18.92 72.14,20.7 68.45,20.7 67.44,21.72 67.44,23.62 79.5,30.48 80.5,30.48 81.79,29.19 81.79,27.81 73.66,23.11 73.66,22.35 76.45,19.56 77.47,19.56 78.4,18.63 78.4,11.68 79.25,10.83
3V3 on Bottom Layer: 60.07,43.18 60.45,43.56 62.61,43.56 62.74,43.43 62.74,30.99 62.36,30.61 60.96,30.61 60.07,31.5
3V3 on Bottom Layer: 17.65,43.31 21.97,43.31 21.97,31.24 21.46,30.73 17.65,30.73 16.89,31.5 16.89,42.54
5V on Top Layer: 53.85,21.84 54.23,22.22 56.13,22.22 56.26,22.1 56.26,19.81 56.64,19.43 58.67,19.43 59.56,20.32 59.56,23.83 71.25,30.48 72.77,30.48 73.41,29.84 73.41,27.58 64.77,22.61 64.77,12.57 65.79,11.56 72.77,11.56 73.41,10.92 73.41,9.78 73.02,9.4 71.63,9.4 71.5,9.27 71.5,8.64 71.75,8.38 73.33,8.38 73.57,8.15 73.57,6.95 73.91,6.6 74.93,6.6 75.31,6.22 75.31,4.88 74.74,4.3 70.63,4.3 70.36,4.57 70.36,8.64 66.04,8.64 61.85,12.83 55.5,12.83 53.85,14.48
5V on Bottom Layer: 17.08,67.22 17.08,68.52 17.4,68.83 21.7,68.83 22.07,68.47 22.07,56.61 21.59,56.13 17.78,56.13 17.02,56.9 17.02,67.16
5V on Bottom Layer: 57.53,68.45 57.91,68.83 59.85,68.83 60.22,68.47 60.22,56.53 59.82,56.13 57.91,56.13 57.53,56.51
GND on Top Layer: -17.27,86.36 124.21,86.36 124.21,-14.61 -17.27,-14.61
GND on Bottom Layer: -41.15,101.98 164.72,101.98 164.72,-52.32 -41.15,-52.32
VCCBAT on Top Layer: 14.22,25.15 15.33,26.26 27.4,26.26 28.7,27.56 35.69,27.56 36.58,26.67 36.58,24.64 35.94,24 33.27,24 31.62,25.65 28.96,25.65 27.69,24.38 27.69,12.91 25.27,12.91 25.27,18.41 15.37,18.41 14.22,19.56
$1N3366 on Top Layer: 15.53,17.65 20.07,17.65 21.08,16.64 21.08,15.62 20.45,14.99 18.03,14.99 17.53,15.49 15.96,15.49 15.53,15.93
$1N3369 on Top Layer: 79.34,8 81.66,8 81.66,3.05 81.15,2.54 79.5,2.54 79.34,2.7
$1N3374 on Top Layer: 17.14,30.73 17.91,29.97 17.91,27.43 17.27,26.8 12.95,26.8 10.92,24.76 10.92,17.53 13.46,14.99 17.65,14.99 18.11,14.53 18.11,11.81 20.01,9.91 29.08,9.91 30.1,8.89 30.1,3.56 29.08,2.54 19.74,2.54 18.41,3.87 18.41,9.27 16.64,11.05 8.91,11.05 7.1,12.85 7.1,17.15 5.84,18.41 3.94,18.41 2.67,19.68 2.67,24.38 3.05,24.76 8.38,24.76 10.67,27.05 10.67,29.72 11.68,30.73
$1N3378 on Top Layer: 37.85,26.67 38.35,27.18 41.02,27.18 41.4,26.8 41.4,25.27 42.04,24.64 44.2,24.64 44.2,22.1 41.91,22.1 41.78,21.97 41.78,20.19 42.04,19.94 45.2,19.94 45.85,19.29 45.85,17.65 45.47,17.27 39.05,17.27 38.27,16.49 38.27,14.52 37.59,13.84 35.05,13.84 33.91,14.99 33.91,17.14 34.54,17.78 37.08,17.78 38.26,18.97 38.26,22.82 37.85,23.24
$1N3384 on Top Layer: 45.85,15.93 46.68,16.76 52.58,16.76 53.21,16.13 53.21,8.25 53.98,7.49 59.18,7.49 59.69,6.98 59.69,4.31 59.19,3.81 48.64,3.81 48.09,4.36 48.09,9.44 45.85,11.69
$1N3387 on Top Layer: 54.1,28.07 54.48,28.45 56,28.45 56.26,28.19 56.26,23.24 56.01,22.99 54.37,22.99 54.1,23.26
$1N3388 on Top Layer: 67.69,8 68.2,8.51 70.23,8.51 70.23,4.7 69.98,4.44 67.82,4.44 67.69,4.57

## Text on the board
Bottom Silkscreen Layer: GND | A12 | A11 | A10 | A09 | A08 | A07 | A06 | A05 | A04 | A03 | A02 | RST | A01 | A00 | +5V | 3V3 | A13 | A14 | A15 | A16 | A17 | A18 | A19 | A20 | A21 | A22 | A23 | A24 | A25 | A26 | A27
Top Layer: 山嵙小队 / 李圣卿 | 刘屹楷 | 殷从容
Top Silkscreen Layer: 5v | gnd | A13 | A15 | A16 | A21 | A26 | GND | +5V | 3V3 | A14 | A17 | A18 | A19 | A20 | A22 | A23 | A24 | A25 | A27 | A12 | A11 | A10 | A09 | A08 | A07 | A06 | A04 | A03 | A02 | RST | A01 | A00 | A05
